# EasyEDA Pro project ProProject_stepper_music_2024-12-04.epro

# Schematic Schematic1
Create Date: 2024-01-15; Page Name: P1; Project Name: stepper_music; Schematic Name: Schematic1; Update Date: 2024-01-16; Company: 嘉立创EDA; Page Size: A4; Version: V1.0
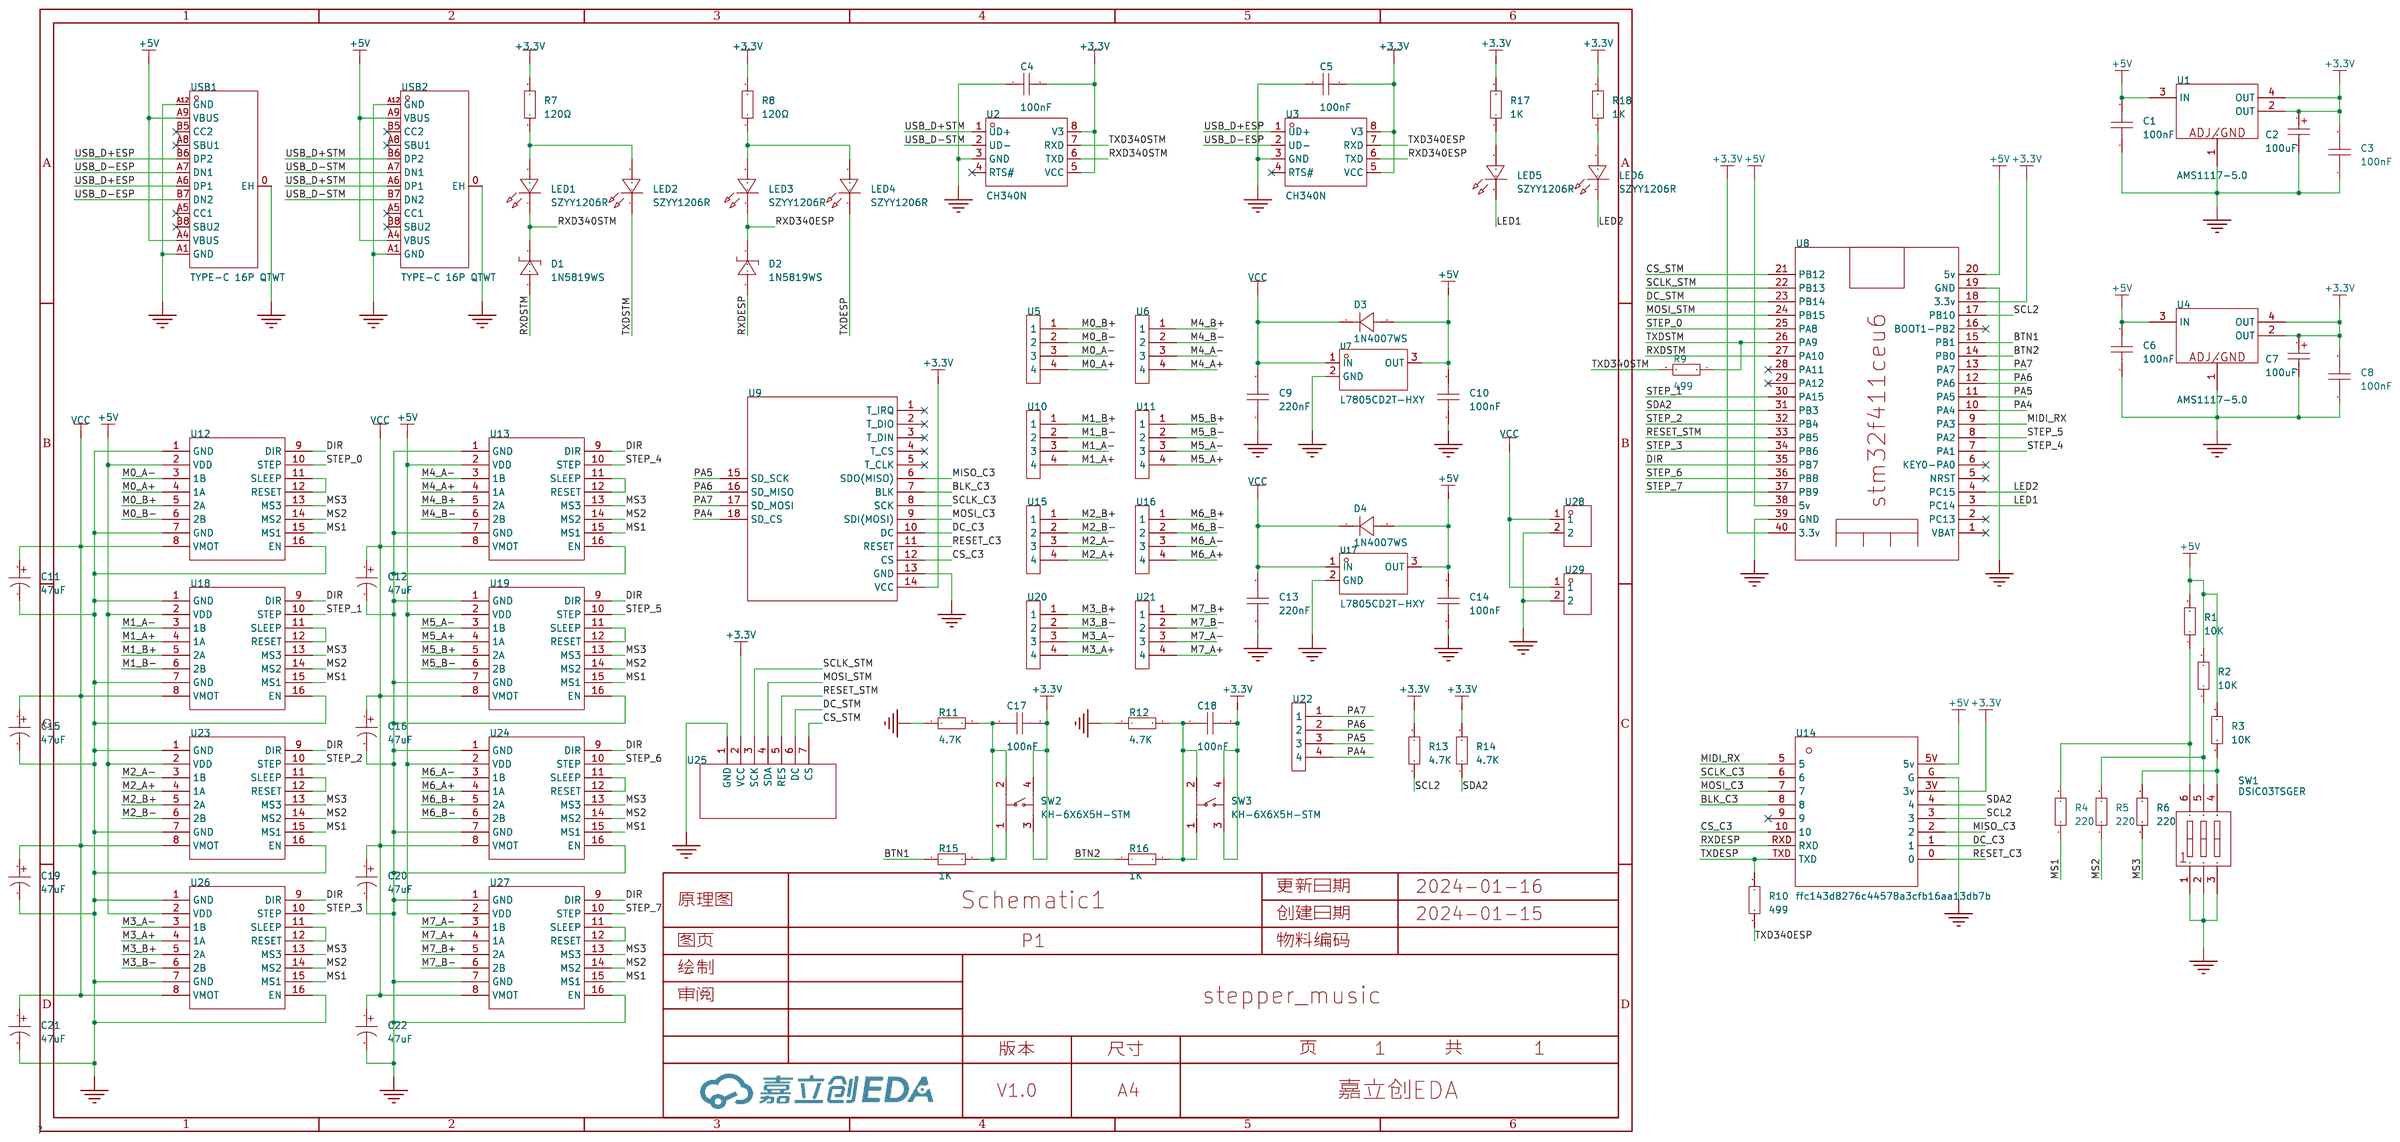
[diagram p0: schematic sheet]

## Parts
C1  100nF  [C1206_]
C2  100uF  [CASE-D_7343]
C3  100nF  [C1206_]
C4  100nF  [C1206_]
C5  100nF  [C1206_]
C6  100nF  [C1206_]
C7  100uF  [CASE-D_7343]
C8  100nF  [C1206_]
C9  220nF  [C1206_]
C10  100nF  [C1206_]
C11  47uF  [CAP-TH_BD6.3-P2.50-D1.0-FD]
C12  47uF  [CAP-TH_BD6.3-P2.50-D1.0-FD]
C13  220nF  [C1206_]
C14  100nF  [C1206_]
C15  47uF  [CAP-TH_BD6.3-P2.50-D1.0-FD]
C16  47uF  [CAP-TH_BD6.3-P2.50-D1.0-FD]
C17  100nF  [C1206_]
C18  100nF  [C1206_]
C19  47uF  [CAP-TH_BD6.3-P2.50-D1.0-FD]
C20  47uF  [CAP-TH_BD6.3-P2.50-D1.0-FD]
C21  47uF  [CAP-TH_BD6.3-P2.50-D1.0-FD]
C22  47uF  [CAP-TH_BD6.3-P2.50-D1.0-FD]
D1  1N5819WS  [SOD-323_L1.8-W1.3-LS2.5-RD]
D2  1N5819WS  [SOD-323_L1.8-W1.3-LS2.5-RD]
D3  1N4007WS  [SOD-323_L1.6-W1.3-LS2.7-RD]
D4  1N4007WS  [SOD-323_L1.6-W1.3-LS2.7-RD]
LED1  SZYY1206R  [LED1206-RD-R_RED]
LED2  SZYY1206R  [LED1206-RD-R_RED]
LED3  SZYY1206R  [LED1206-RD-R_RED]
LED4  SZYY1206R  [LED1206-RD-R_RED]
LED5  SZYY1206R  [LED1206-RD-R_RED]
LED6  SZYY1206R  [LED1206-RD-R_RED]
R1  10K  [R1206-1]
R2  10K  [R1206-1]
R3  10K  [R1206-1]
R4  220  [R1206-1]
R5  220  [R1206-1]
R6  220  [R1206-1]
R7  120Ω  [R1206-1]
R8  120Ω  [R1206-1]
R9  499  [R1206-1]
R10  499  [R1206-1]
R11  4.7K  [R1206-1]
R12  4.7K  [R1206-1]
R13  4.7K  [R1206-1]
R14  4.7K  [R1206-1]
R15  1K  [R1206-1]
R16  1K  [R1206-1]
R17  1K  [R1206-1]
R18  1K  [R1206-1]
SW1  DSIC03TSGER  [SW-SMD_3P-L7.6-W6.0-P2.54-LS9.3-BL]
SW2  KH-6X6X5H-STM  [SW-SMD_4P-L6.0-W6.0-P4.50-LS9.0-2]
SW3  KH-6X6X5H-STM  [SW-SMD_4P-L6.0-W6.0-P4.50-LS9.0-2]
U1  AMS1117-5.0  [SOT-223-3_L6.4-W3.5-P2.30-LS7.0-BR]
U2  CH340N  [SOP-8_L4.9-W3.9-P1.27-LS6.0-BL]
U3  CH340N  [SOP-8_L4.9-W3.9-P1.27-LS6.0-BL]
U4  AMS1117-5.0  [SOT-223-3_L6.4-W3.5-P2.30-LS7.0-BR]
U5  -  [2.54 - 4P]
U6  -  [2.54 - 4P]
U7  L7805CD2T-HXY  [TO-263-2_L10.2-W8.5-P2.54-LS15.2-TL]
U8  -  [stm32f411ceu6]
U9  -  [2.8inch TFT LCD]
U10  -  [2.54 - 4P]
U11  -  [2.54 - 4P]
U12  -  [a4988 module]
U13  -  [a4988 module]
U14  ffc143d8276c44578a3cfb16aa13db7b  [esp32c3-mini]
U15  -  [2.54 - 4P]
U16  -  [2.54 - 4P]
U17  L7805CD2T-HXY  [TO-263-2_L10.2-W8.5-P2.54-LS15.2-TL]
U18  -  [a4988 module]
U19  -  [a4988 module]
U20  -  [2.54 - 4P]
U21  -  [2.54 - 4P]
U22  -  [2.54 - 4P]
U23  -  [a4988 module]
U24  -  [a4988 module]
U25  -  [1.3inch OLED module]
U26  -  [a4988 module]
U27  -  [a4988 module]
U28  ={Manufacturer Part} /  [CONN-TH_2P-P5.00_L7.6-W10.0]
U29  ={Manufacturer Part} /  [CONN-TH_2P-P5.00_L7.6-W10.0]
USB1  TYPE-C 16P QTWT  [USB-TYPE-C-SMD_TYPE-C-16P-QTWT]
USB2  TYPE-C 16P QTWT  [USB-TYPE-C-SMD_TYPE-C-16P-QTWT]

## Library data of the parts
C1 C3 C6 C8-C10 C13 C14 C17 C18 = CAP_0603: Supplier Footprint: 0603
C2 C7 = TAJD337K010RNJ: 容值:330uF;精度:±10%;额定电压:10V;等效串联电阻:900mΩ@100kHz;工作温度:-55℃~+125℃;; LCSC Part Name: 330uF ±10% 10V; Supplier Part: C7226; Manufacturer: Kyocera AVX; JLCPCB Part Class: 扩展库; Datasheet: https://atta.szlcsc.com/upload/public/pdf/source/20160107/1457707749490.pdf; Supplier: LCSC; Tolerance: ±10%; Rated Voltage: 10V; Equivalent Series Resistance(ESR): 900mΩ@100kHz; Operating Temperature: -55℃~+125℃
C4 C5 = CL05B104KO5NNNC: 容值:100nF;精度:±10%;额定电压:16V;材质(温度系数):X7R;; LCSC Part Name: 100nF ±10% 16V; Supplier Part: C1525; Manufacturer: SAMSUNG(三星); Supplier Footprint: 0402; JLCPCB Part Class: Basic Part; Datasheet: https://atta.szlcsc.com/upload/public/pdf/source/20160103/1457707674891.pdf; Supplier: LCSC; Tolerance: ±10%; Voltage Rated: 16V; Temperature Coefficient: X7R
C11 C12 C15 C16 C19-C22 = KM476M050E11RR0VH2FP0: 容值:47uF;精度:±20%;额定电压:50V;; LCSC Part Name: 47uF ±20% 50V; Supplier Part: C45101; Manufacturer: CX(承兴); Supplier Footprint: 插件,D6.3xL11mm; JLCPCB Part Class: 扩展库; Datasheet: https://atta.szlcsc.com/upload/public/pdf/source/20230413/4F329AA96A66424FD3FF29340EA7427F.pdf; Supplier: LCSC; Tolerance: ±20%; Rated Voltage: 50V; Lead Spacing: 2.5mm; φD: 6.3mm; L: 11mm; Lifetime @ Temp: 1000hrs@105℃
D1 D2 = 1N5819WS_C191023: 直流反向耐压(Vr):40V;平均整流电流(Io):1A;正向压降(Vf):600mV@1A;; LCSC Part Name: 40V 1A 600mV@1A; Supplier Part: C191023; Manufacturer: Hottech(合科泰); Supplier Footprint: SOD-323; JLCPCB Part Class: Basic Part; Datasheet: https://atta.szlcsc.com/upload/public/pdf/source/20220428/3CB86FD8D28D653594B4E35F9D5AEFD9.pdf; Supplier: LCSC; Reverse Voltage (Vr): 40V; Average Rectified Current (Io): 1A; Forward Voltage (Vf@If): 600mV@1A
D3 D4 = 1N4007WS_C2687395: 二极管配置:-;正向压降(Vf):1V@50mA;直流反向耐压(Vr):300V;平均整流电流(Io):300mA;; LCSC Part Name: 电压:300V 电流:300mA; Supplier Part: C2687395; Manufacturer: JSMSEMI(杰盛微); Supplier Footprint: SOD-323; JLCPCB Part Class: 扩展库; Datasheet: https://atta.szlcsc.com/upload/public/pdf/source/20220125/703811846266D8EFA59826CD7BEA3161.pdf; Supplier: LCSC; Forward Voltage (Vf@If): 1V@50mA; Reverse Voltage (Vr): 300V; Average Rectified Current (Io): 300mA; Reverse Leakage Current: 1uA@75V
LED1-LED6 = SZYY1206R: 发光颜色:红灯;二极管配置:-;主波长:615nm~630nm;色温:-;功率:40mW;安装方式:-;; LCSC Part Name: 红灯; Supplier Part: C434438; Manufacturer: yongyu(永裕光电); Supplier Footprint: 1206; JLCPCB Part Class: Extended Part; Datasheet: https://atta.szlcsc.com/upload/public/pdf/source/20200628/C434438_2D67D2A0D30E1ECD9789F51185A39ACF.pdf; Supplier: LCSC; Emitted Color: 红灯; Lens Color: 无色透明; Dominant Wavelength: 615nm~630nm; Peak Wavelength: 645nm; Forward Current: 20mA; Power Dissipation: 40mW; Viewing Angle: 120°; Operating Temperature: -40℃~+85℃
R1-R6 R9-R18 = Res_0603: Supplier Footprint: 0603
R7 R8 = 0603WAF1200T5E: 电阻类型:厚膜电阻;阻值:120Ω;精度:±1%;功率:100mW;; LCSC Part Name: 120Ω ±1% 100mW; Supplier Part: C22787; Manufacturer: UNI-ROYAL(厚声); Supplier Footprint: 0603; JLCPCB Part Class: Basic Part; Datasheet: https://atta.szlcsc.com/upload/public/pdf/source/20200306/C422600_1E6D84923E4A46A82E41ADD87F860B5C.pdf; Supplier: LCSC; Type: 厚膜电阻; Tolerance: ±1%; Power(Watts): 100mW; Temperature Coefficient: ±100ppm/℃; Overload Voltage (Max): 75V; Operating Temperature Range: -55℃~+155℃
SW1 = DSIC03TSGER: 电路结构:单刀单掷;开关位数:3位;额定电流:25mA;额定电压:24V;使用寿命:3千次;颜色:黑色;; LCSC Part Name: 3位 2.54mm脚距 低手柄 拨码开关; Supplier Part: C5123695; Manufacturer: 康深; Supplier Footprint: SMD-6P,6x7.6mm; JLCPCB Part Class: Extended Part; Datasheet: https://atta.szlcsc.com/upload/public/pdf/source/20220802/2B0B0211448CD9140CAD8FC2231D587F.pdf; Supplier: LCSC; Circuit: 单刀单掷; Number of Positions: 3位; Lead Pitch: 2.54mm; Current Rating: 25mA; Voltage Rating: 24V; Operating Temperature: -30℃~+85℃; Operating Life: 3千次; Color: 黑色
SW2 SW3 = KH-6X6X5H-STM: 电路结构:单刀单掷;带支架:否;触点电流:50mA;额定电压(DC):12V;安装方式:立贴;机械寿命:8万次;; LCSC Part Name: 6*6*5mm 立贴 轻触开关; Supplier Part: C2837531; Manufacturer: kinghelm(金航标); Supplier Footprint: SMD; JLCPCB Part Class: Extended Part; Datasheet: https://atta.szlcsc.com/upload/public/pdf/source/20210608/C2837531_45E87AB996CE723B09405FF2EA209C4C.pdf; Supplier: LCSC; Circuit: 单刀单掷; Actuator Style: 圆形按钮; Switch Length: 6mm; Switch Width: 6mm; Switch Height: 5mm; Strike Gundam: 否; Contact Current: 50mA; Voltage Rating (DC): 12V; Mounting Style: 立贴; Actuator/Cap Color: 黑色; Pin Style: 鸥翼型; Mechanical Life: 8万次
U1 U4 = AMS1117-5.0_C2992571: Supplier Part: C2992571; Manufacturer: 国芯佳品; Supplier Footprint: SOT-223-3; JLCPCB Part Class: Extended Part; Datasheet: https://atta.szlcsc.com/upload/public/pdf/source/20220729/0D21C21EC310E4778671BF6BAE438640.pdf; Supplier: LCSC
U2 U3 = CH340N: LCSC Part Name: USB转串口芯片 CH340; Supplier Part: C2977777; Manufacturer: WCH(南京沁恒); Supplier Footprint: SOP-8; JLCPCB Part Class: Extended Part; Datasheet: https://atta.szlcsc.com/upload/public/pdf/source/20220223/82A45E4FF89B3EDCAD50B354450A7EF4.pdf; Supplier: LCSC
U5 U6 U10 U11 U15 U16 U20-U22 = 2.54 - 4P: 间距2.54排针 4P
U7 U17 = L7805CD2T-HXY: 输出类型:固定;最大输入电压:35V;输出电压:5V;输出电流:1A;输出极性:正;; LCSC Part Name: L7805CD2T 输入35V 输出5V 1A L7805C2T; Supplier Part: C7469133; Manufacturer: HXY MOSFET(华轩阳电子); Supplier Footprint: TO-263; JLCPCB Part Class: 扩展库; Datasheet: https://atta.szlcsc.com/upload/public/pdf/source/20230804/7B1B56C03EC7F4A7A79582162CF47805.pdf; Supplier: LCSC; Output Type: 固定; Maximum Input Voltage: 35V; Output Voltage: 5V; Output Current: 1A; Output Polarity: 正; Number of Outputs: 1
U8 = stm3f411ceu6: stm32f411ceu6 https://www.taobao.com/list/item/594670660262.htm
U9 = 2.8inch TFT LCD: Driver: ILI9341
U12 U13 U18 U19 U23 U24 U26 U27 = a4988: a4988 stepper motor driver module
U14 = esp32c3_super_mini: esp32c3-mini No-logo
U25 = 1.3 inch OLED: SH1106 Driver 128*64
U28 U29 = DB301V-5.0-2P-BU-S: 间距:5mm;结构:1x2P;排数:1;每排PIN数:2;安装方式:直插;额定电流:17.5A;额定电压:250V;线规 - AWG:14~22;线规 - mm2:1.5;工作温度范围:-40℃~+120℃;颜色:蓝色;; LCSC Part Name: 5mm 1x2P 排数:1 每排P数:2 直插; Supplier Part: C395882; Manufacturer: DIBO(地博电气); Supplier Footprint: 插件,P=5mm; JLCPCB Part Class: Extended Part; Datasheet: https://atta.szlcsc.com/upload/public/pdf/source/20230321/D511151DA9A574FE7610C3CBEF6C1AC3.pdf; Supplier: LCSC; Pitch: 5mm; Structure: 1x2P; Number of Rows: 1; Number of PINs Per Row: 2; Mounting Style: 直插; Current Rating (Max): 17.5A; Voltage Rating (Max): 250V; Wire Gauge - AWG: 14~22; Wire Gauge - mm2: 1.5; Operating Temperature Range: -40℃~+120℃; Color: 蓝色; Number of Pins: 2P
USB1 USB2 = TYPE-C 16P QTWT: 连接器类型:Type-C;标准:-;公母:母;端口数量:1;触点数量:16P;安装方式:卧贴;额定电流 - 电源:3A;触头材质:-;触头镀层:-;工作温度范围:-25℃~+85℃;焊接温度(最大值):-;; LCSC Part Name: Type-C 母 卧贴; Supplier Part: C5187472; Manufacturer: SHOU HAN(首韩); Supplier Footprint: SMD; JLCPCB Part Class: 扩展库; Datasheet: https://atta.szlcsc.com/upload/public/pdf/source/20220929/9CA39B32C19F2C1116A695DA9353B6B2.pdf; Supplier: LCSC; Connector Type: Type-C; Gender: 母; Number of Ports: 1; Number of Contacts: 16P; Mounting Style: 卧贴; Current Rating - Power (Max): 3A; Operating Temperature Range: -25℃~+85℃

## Nets
+3.3V: C2.1 C3.2 C4.2 C5.2 C7.1 C8.2 C17.2 C18.2 R7.2 R8.2 R13.2 R14.2 R17.2 R18.2 SW2.3 SW2.4 SW3.3 SW3.4 U1.2(OUT) U1.4(OUT) U2.5(VCC) U2.8(V3) U3.5(VCC) U3.8(V3) U4.2(OUT) U4.4(OUT) U8.18(3.3v) U8.40(3.3v) U9.14(VCC) U14.3V(3v) U25.2(VCC)
+5V: C1.2 C6.2 C10.2 C14.2 D3.2(A) D4.2(A) R1.2 R2.2 R3.2 U1.3(IN) U4.3(IN) U7.3(OUT) U8.20(5v) U8.38(5v) U12.2(VDD) U13.2(VDD) U14.5V(5v) U17.3(OUT) U18.2(VDD) U19.2(VDD) U23.2(VDD) U24.2(VDD) U26.2(VDD) U27.2(VDD) USB1.A4(VBUS) USB1.A9(VBUS) USB2.A4(VBUS) USB2.A9(VBUS)
GND: C1.1 C2.2 C3.1 C4.1 C5.1 C6.1 C7.2 C8.1 C9.1 C10.1 C11.2 C12.2 C13.1 C14.1 C15.2 C16.2 C19.2 C20.2 C21.2 C22.2 R11.1 R12.1 SW1.1(A1) SW1.2(A2) SW1.3(A3) U1.1(ADJ/GND) U2.3(GND) U3.3(GND) U4.1(ADJ/GND) U7.2(GND) U8.19(GND) U8.39(GND) U9.13(GND) U12.1(GND) U12.7(GND) U12.16(EN) U13.1(GND) U13.7(GND) U13.16(EN) U14.G U17.2(GND) U18.1(GND) U18.7(GND) U18.16(EN) U19.1(GND) U19.7(GND) U19.16(EN) U23.1(GND) U23.7(GND) U23.16(EN) U24.1(GND) U24.7(GND) U24.16(EN) U25.1(GND) U26.1(GND) U26.7(GND) U26.16(EN) U27.1(GND) U27.7(GND) U27.16(EN) U28.2 U29.2 USB1.0(EH) USB1.A1(GND) USB1.A12(GND) USB2.0(EH) USB2.A1(GND) USB2.A12(GND)
VCC: C9.2 C11.1 C12.1 C13.2 C15.1 C16.1 C19.1 C20.1 C21.1 C22.1 D3.1(K) D4.1(K) U7.1(IN) U12.8(VMOT) U13.8(VMOT) U17.1(IN) U18.8(VMOT) U19.8(VMOT) U23.8(VMOT) U24.8(VMOT) U26.8(VMOT) U27.8(VMOT) U28.1 U29.1
BLK_C3: U9.7(BLK) U14.8
BTN1: R15.1 U8.15(PB1)
BTN2: R16.1 U8.14(PB0)
CS_C3: U9.12(CS) U14.10
CS_STM: U8.21(PB12) U25.7(CS)
DC_C3: U9.10(DC) U14.1
DC_STM: U8.23(PB14) U25.6(DC)
DIR: U8.35(PB7) U12.9(DIR) U13.9(DIR) U18.9(DIR) U19.9(DIR) U23.9(DIR) U24.9(DIR) U26.9(DIR) U27.9(DIR)
LED1: LED5.1 U8.3(PC14)
LED2: LED6.1 U8.4(PC15)
M0_A+: U5.4 U12.4(1A)
M0_A-: U5.3 U12.3(1B)
M0_B+: U5.1 U12.5(2A)
M0_B-: U5.2 U12.6(2B)
M1_A+: U10.4 U18.4(1A)
M1_A-: U10.3 U18.3(1B)
M1_B+: U10.1 U18.5(2A)
M1_B-: U10.2 U18.6(2B)
M2_A+: U15.4 U23.4(1A)
M2_A-: U15.3 U23.3(1B)
M2_B+: U15.1 U23.5(2A)
M2_B-: U15.2 U23.6(2B)
M3_A+: U20.4 U26.4(1A)
M3_A-: U20.3 U26.3(1B)
M3_B+: U20.1 U26.5(2A)
M3_B-: U20.2 U26.6(2B)
M4_A+: U6.4 U13.4(1A)
M4_A-: U6.3 U13.3(1B)
M4_B+: U6.1 U13.5(2A)
M4_B-: U6.2 U13.6(2B)
M5_A+: U11.4 U19.4(1A)
M5_A-: U11.3 U19.3(1B)
M5_B+: U11.1 U19.5(2A)
M5_B-: U11.2 U19.6(2B)
M6_A+: U16.4 U24.4(1A)
M6_A-: U16.3 U24.3(1B)
M6_B+: U16.1 U24.5(2A)
M6_B-: U16.2 U24.6(2B)
M7_A+: U21.4 U27.4(1A)
M7_A-: U21.3 U27.3(1B)
M7_B+: U21.1 U27.5(2A)
M7_B-: U21.2 U27.6(2B)
MIDI_RX: U8.9(PA3) U14.5
MISO_C3: U9.6(SDO(MISO)) U14.2
MOSI_C3: U9.9(SDI(MOSI)) U14.7
MOSI_STM: U8.24(PB15) U25.4(SDA)
MS1: R4.1 U12.15(MS1) U13.15(MS1) U18.15(MS1) U19.15(MS1) U23.15(MS1) U24.15(MS1) U26.15(MS1) U27.15(MS1)
MS2: R5.1 U12.14(MS2) U13.14(MS2) U18.14(MS2) U19.14(MS2) U23.14(MS2) U24.14(MS2) U26.14(MS2) U27.14(MS2)
MS3: R6.1 U12.13(MS3) U13.13(MS3) U18.13(MS3) U19.13(MS3) U23.13(MS3) U24.13(MS3) U26.13(MS3) U27.13(MS3)
PA4: U8.10(PA4) U9.18(SD_CS) U22.4
PA5: U8.11(PA5) U9.15(SD_SCK) U22.3
PA6: U8.12(PA6) U9.16(SD_MISO) U22.2
PA7: U8.13(PA7) U9.17(SD_MOSI) U22.1
RESET_C3: U9.11(RESET) U14.0
RESET_STM: U8.33(PB5) U25.5(RES)
RXD340ESP: D2.1(C) LED3.1 U3.6(TXD)
RXD340STM: D1.1(C) LED1.1 U2.6(TXD)
RXDESP: D2.2(A) U14.RXD
RXDSTM: D1.2(A) U8.27(PA10)
SCL2: R13.1 U8.17(PB10) U14.3
SCLK_C3: U9.8(SCK) U14.6
SCLK_STM: U8.22(PB13) U25.3(SCK)
SDA2: R14.1 U8.31(PB3) U14.4
STEP_0: U8.25(PA8) U12.10(STEP)
STEP_1: U8.30(PA15) U18.10(STEP)
STEP_2: U8.32(PB4) U23.10(STEP)
STEP_3: U8.34(PB6) U26.10(STEP)
STEP_4: U8.7(PA1) U13.10(STEP)
STEP_5: U8.8(PA2) U19.10(STEP)
STEP_6: U8.36(PB8) U24.10(STEP)
STEP_7: U8.37(PB9) U27.10(STEP)
TXD340ESP: R10.1 U3.7(RXD)
TXD340STM: R9.2 U2.7(RXD)
TXDESP: LED4.1 R10.2 U14.TXD
TXDSTM: LED2.1 R9.1 U8.26(PA9)
USB_D+ESP: U3.1(UD+) USB1.A6(DP1) USB1.B6(DP2)
USB_D+STM: U2.1(UD+) USB2.A6(DP1) USB2.B6(DP2)
USB_D-ESP: U3.2(UD-) USB1.A7(DN1) USB1.B7(DN2)
USB_D-STM: U2.2(UD-) USB2.A7(DN1) USB2.B7(DN2)
$1N1936: LED3.2 LED4.2 R8.1
$1N2808: LED1.2 LED2.2 R7.1
$1N4483: U26.11(SLEEP) U26.12(RESET)
$1N4488: U27.11(SLEEP) U27.12(RESET)
$1N4493: U23.11(SLEEP) U23.12(RESET)
$1N4498: U24.11(SLEEP) U24.12(RESET)
$1N4503: U19.11(SLEEP) U19.12(RESET)
$1N4508: U13.11(SLEEP) U13.12(RESET)
$1N4513: U12.11(SLEEP) U12.12(RESET)
$1N4518: U18.11(SLEEP) U18.12(RESET)
$1N11425: LED5.2 R17.1
$1N11428: LED6.2 R18.1
$1N16587: C17.1 R11.2 R15.2 SW2.1 SW2.2
$1N16647: C18.1 R12.2 R16.2 SW3.1 SW3.2
$1N18562: R3.1 R6.2 SW1.4(B3)
$1N18573: R2.1 R5.2 SW1.5(B2)
$1N18582: R1.1 R4.2 SW1.6(B1)

Not connected (* = marked no-connect by the designer): U2 4(RTS#)*; U3 4(RTS#)*; U8 1(VBAT)* 2(PC13)* 5(NRST)* 6(KEY0-PA0)* 16(BOOT1-PB2)* 28(PA11)* 29(PA12)*; U9 1(T_IRQ)* 2(T_DIO)* 3(T_DIN)* 4(T_CS)* 5(T_CLK)*; U14 9*; USB1 A5(CC1)* A8(SBU1)* B5(CC2)* B8(SBU2)*; USB2 A5(CC1)* A8(SBU1)* B5(CC2)* B8(SBU2)*

# Board PCB1
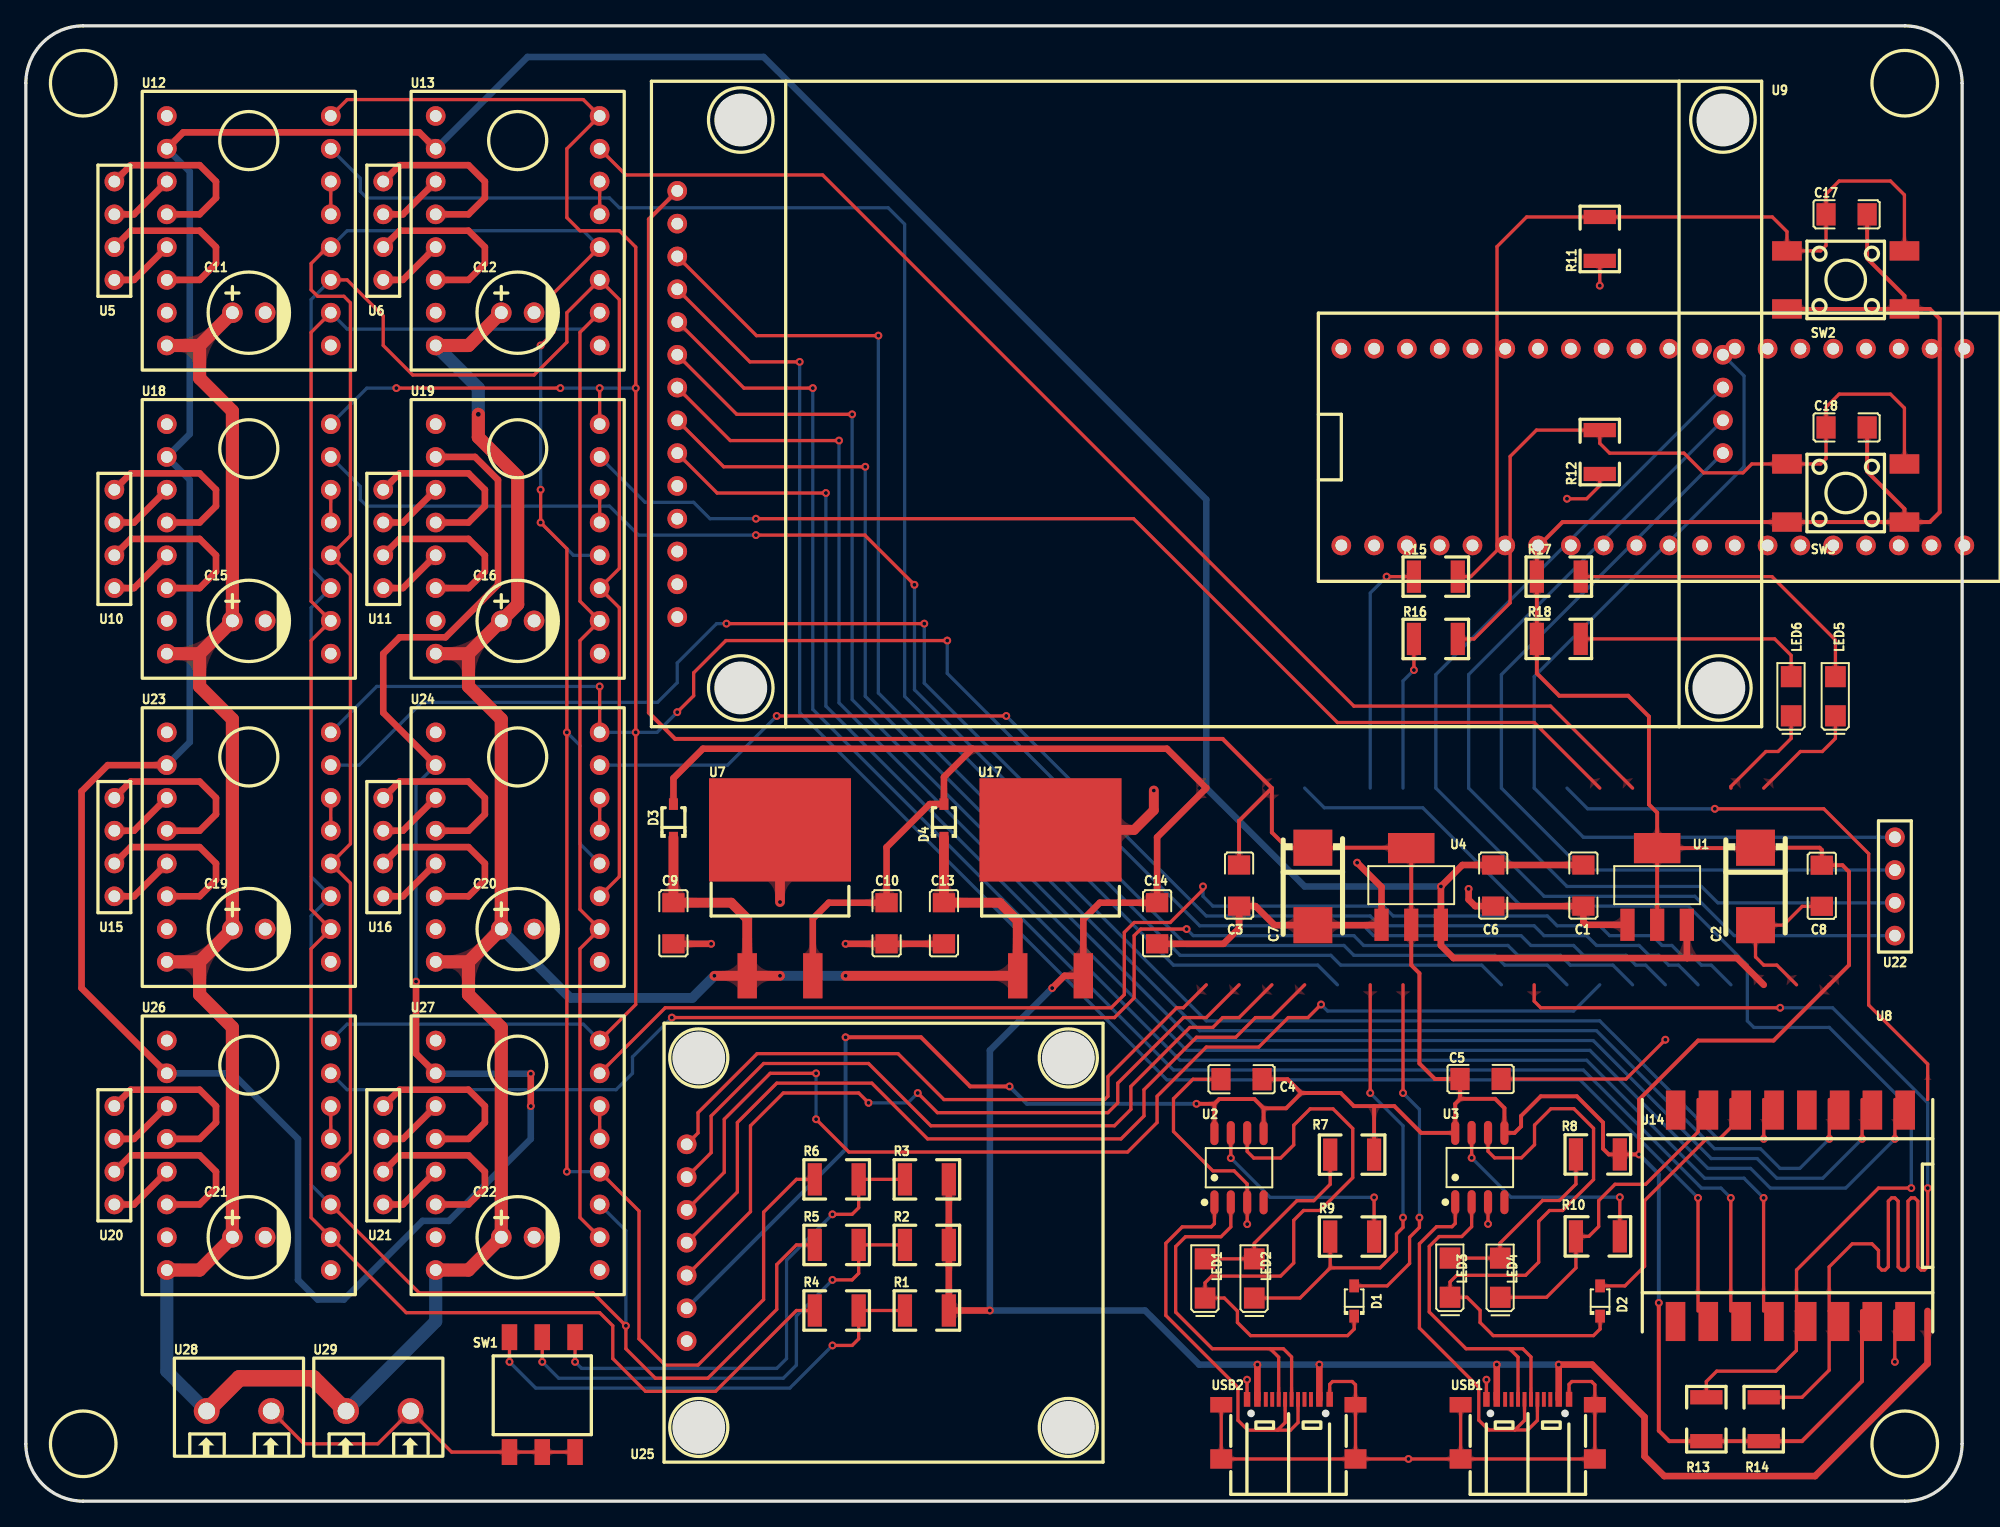
[diagram p1: board, top side]
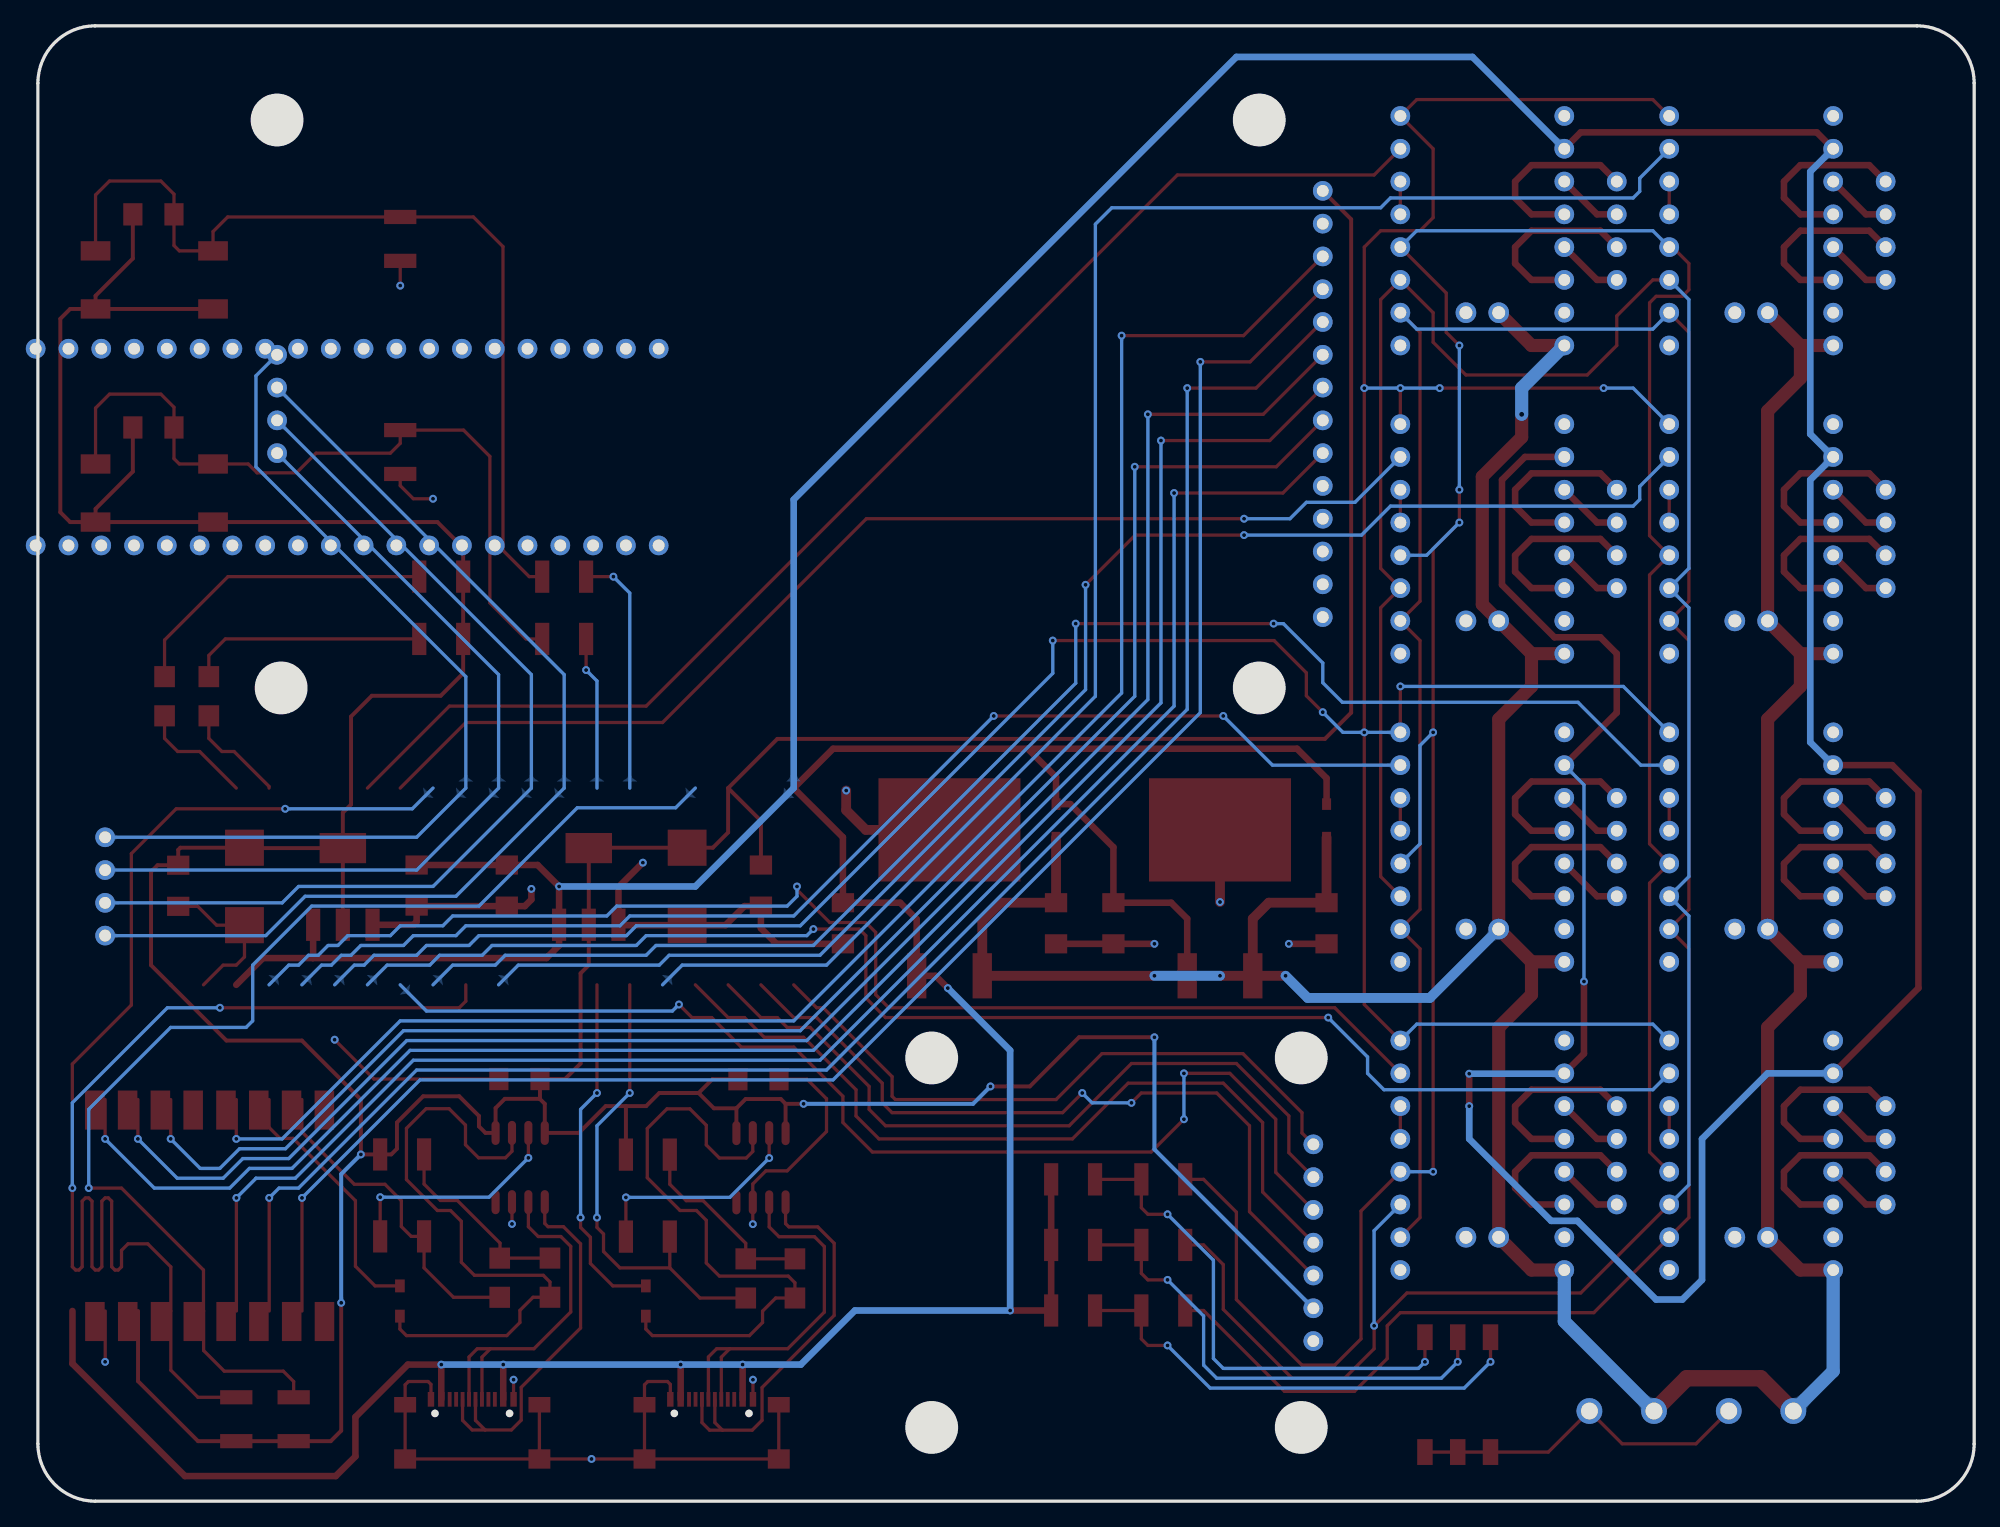
[diagram p2: board, bottom side, seen from below]

Outline 149.99 x 114.3 mm; copper layers: Top Layer, Bottom Layer. Coordinates in mm from the lower left corner of the outline.
Outline path: 0,109.85 0,4.44 arc(1.3,1.3) 4.44,0 145.54,0 arc(148.69,1.3) 149.99,4.44 149.99,109.85 arc(148.69,113) 145.54,114.3 4.44,114.3 arc(1.3,113) 0,109.85
Stack: Top Layer 0.035mm / Dielectric1 1.51mm FR4 er 4.5 / Bottom Layer 0.035mm

## Design rules (mm)
template: JLCPCB Capability(Two Layers Board)
spacing copperThickness1oz (default): track to track 0.102, other pairs 0.152 to 0.3
spacing copperThickness2oz: track to track 0.203, other pairs 0.152 to 0.3
track width copperThickness1oz (default): min 0.127, default 0.254, max 2.54
track width copperThickness2oz: min 0.203, default 0.254, max 2.54
differential pair differentialPair (default): width min 0.127, default 0.254, max 2.54; gap min 0.152, default 0.152
via viaSize (default): diameter min 0.5, default 0.61, max 10; hole min 0.3, default 0.305, max 6.3

## Placement (name value [footprint] x y rotation side)
C1  100nF  [C1206_]  120.65 47.62 90 top
C2  100uF  [CASE-D_7343]  133.99 47.62 90 top
C3  100nF  [C1206_]  93.98 47.62 90 top
C4  100nF  [C1206_]  94.1 32.69 0 top
C5  100nF  [C1206_]  112.76 32.71 180 top
C6  100nF  [C1206_]  113.66 47.62 90 top
C7  100uF  [CASE-D_7343]  99.69 47.62 90 top
C8  100nF  [C1206_]  139.12 47.61 90 top
C9  220nF  [C1206_]  50.17 44.7 90 top
C10  100nF  [C1206_]  66.68 44.7 90 top
C11  47uF  [CAP-TH_BD6.3-P2.50-D1.0-FD]  17.27 92.07 0 top
C12  47uF  [CAP-TH_BD6.3-P2.50-D1.0-FD]  38.1 92.07 0 top
C13  220nF  [C1206_]  71.12 44.7 90 top
C14  100nF  [C1206_]  87.63 44.7 90 top
C15  47uF  [CAP-TH_BD6.3-P2.50-D1.0-FD]  17.27 68.2 0 top
C16  47uF  [CAP-TH_BD6.3-P2.50-D1.0-FD]  38.1 68.2 0 top
C17  100nF  [C1206_]  140.97 99.69 0 top
C18  100nF  [C1206_]  140.97 83.18 0 top
C19  47uF  [CAP-TH_BD6.3-P2.50-D1.0-FD]  17.27 44.32 0 top
C20  47uF  [CAP-TH_BD6.3-P2.50-D1.0-FD]  38.1 44.32 0 top
C21  47uF  [CAP-TH_BD6.3-P2.50-D1.0-FD]  17.27 20.45 0 top
C22  47uF  [CAP-TH_BD6.3-P2.50-D1.0-FD]  38.1 20.45 0 top
D1  1N5819WS  [SOD-323_L1.8-W1.3-LS2.5-RD]  102.9 15.51 90 top
D2  1N5819WS  [SOD-323_L1.8-W1.3-LS2.5-RD]  121.94 15.51 90 top
D3  1N4007WS  [SOD-323_L1.6-W1.3-LS2.7-RD]  50.17 52.7 90 top
D4  1N4007WS  [SOD-323_L1.6-W1.3-LS2.7-RD]  71.12 52.7 90 top
LED1  SZYY1206R  [LED1206-RD-R_RED]  91.35 17.26 90 top
LED2  SZYY1206R  [LED1206-RD-R_RED]  95.16 17.26 90 top
LED3  SZYY1206R  [LED1206-RD-R_RED]  110.32 17.32 90 top
LED4  SZYY1206R  [LED1206-RD-R_RED]  114.21 17.31 90 top
LED5  SZYY1206R  [LED1206-RD-R_RED]  140.17 62.36 90 top
LED6  SZYY1206R  [LED1206-RD-R_RED]  136.75 62.36 90 top
R1  10K  [R1206-1]  69.8 14.77 0 top
R2  10K  [R1206-1]  69.8 19.85 0 top
R3  10K  [R1206-1]  69.8 24.93 0 top
R4  220  [R1206-1]  62.81 14.77 0 top
R5  220  [R1206-1]  62.81 19.85 0 top
R6  220  [R1206-1]  62.81 24.93 0 top
R7  120Ω  [R1206-1]  102.74 26.85 0 top
R8  120Ω  [R1206-1]  121.77 26.86 0 top
R9  499  [R1206-1]  102.74 20.5 0 top
R10  499  [R1206-1]  121.77 20.51 180 top
R11  4.7K  [R1206-1]  121.92 97.79 90 top
R12  4.7K  [R1206-1]  121.92 81.28 90 top
R13  4.7K  [R1206-1]  130.18 6.35 270 top
R14  4.7K  [R1206-1]  134.62 6.35 270 top
R15  1K  [R1206-1]  109.22 71.63 0 top
R16  1K  [R1206-1]  109.22 66.8 0 top
R17  1K  [R1206-1]  118.75 71.63 180 top
R18  1K  [R1206-1]  118.75 66.8 180 top
SW1  DSIC03TSGER  [SW-SMD_3P-L7.6-W6.0-P2.54-LS9.3-BL]  40 8.25 0 top
SW2  KH-6X6X5H-STM  [SW-SMD_4P-L6.0-W6.0-P4.50-LS9.0-2]  140.97 94.61 0 top
SW3  KH-6X6X5H-STM  [SW-SMD_4P-L6.0-W6.0-P4.50-LS9.0-2]  140.97 78.1 0 top
U1  AMS1117-5.0  [SOT-223-3_L6.4-W3.5-P2.30-LS7.0-BR]  126.37 47.62 270 top
U2  CH340N  [SOP-8_L4.9-W3.9-P1.27-LS6.0-BL]  93.97 25.83 0 top
U3  CH340N  [SOP-8_L4.9-W3.9-P1.27-LS6.0-BL]  112.63 25.85 0 top
U4  AMS1117-5.0  [SOT-223-3_L6.4-W3.5-P2.30-LS7.0-BR]  107.31 47.62 270 top
U5  -  [2.54 - 4P]  6.86 94.61 90 top
U6  -  [2.54 - 4P]  27.69 94.61 90 top
U7  L7805CD2T-HXY  [TO-263-2_L10.2-W8.5-P2.54-LS15.2-TL]  58.42 46.35 90 top
U8  -  [stm32f411ceu6]  139.7 55.24 90 top
U9  -  [2.8inch TFT LCD]  50.46 68.49 270 top
U10  -  [2.54 - 4P]  6.86 70.74 90 top
U11  -  [2.54 - 4P]  27.69 70.74 90 top
U12  -  [a4988 module]  10.92 107.31 0 top
U13  -  [a4988 module]  31.75 107.31 0 top
U14  ffc143d8276c44578a3cfb16aa13db7b  [esp32c3-mini]  147.32 31.11 270 top
U15  -  [2.54 - 4P]  6.86 46.86 90 top
U16  -  [2.54 - 4P]  27.69 46.86 90 top
U17  L7805CD2T-HXY  [TO-263-2_L10.2-W8.5-P2.54-LS15.2-TL]  79.38 46.35 90 top
U18  -  [a4988 module]  10.92 83.44 0 top
U19  -  [a4988 module]  31.75 83.44 0 top
U20  -  [2.54 - 4P]  6.86 22.99 90 top
U21  -  [2.54 - 4P]  27.69 22.99 90 top
U22  -  [2.54 - 4P]  144.78 43.81 90 top
U23  -  [a4988 module]  10.92 59.56 0 top
U24  -  [a4988 module]  31.75 59.56 0 top
U25  -  [1.3inch OLED module]  83.44 3.03 90 top
U26  -  [a4988 module]  10.92 35.69 0 top
U27  -  [a4988 module]  31.75 35.69 0 top
U28  ={Manufacturer Part} /  [CONN-TH_2P-P5.00_L7.6-W10.0]  16.51 6.98 0 top
U29  ={Manufacturer Part} /  [CONN-TH_2P-P5.00_L7.6-W10.0]  27.31 6.98 0 top
USB1  TYPE-C 16P QTWT  [USB-TYPE-C-SMD_TYPE-C-16P-QTWT]  116.34 5.58 0 top
USB2  TYPE-C 16P QTWT  [USB-TYPE-C-SMD_TYPE-C-16P-QTWT]  97.8 5.58 0 top

## Footprints (pads in the part's own frame, mm; a bottom-side part is the same pattern mirrored in y, then rotated)
1.3inch OLED module
  round 1.524 hole 0.914: 1(9.38,32.25) 2(11.92,32.25) 3(14.46,32.25) 4(17,32.25) 5(19.54,32.25) 6(22.08,32.25) 7(24.62,32.25)
2.8inch TFT LCD
  round 1.524 hole 0.914: 1(0,0) 2(-2.54,0) 3(-5.08,0) 4(-7.62,0) 5(-10.16,0) 6(-12.7,0) 7(-15.24,0) 8(-17.78,0) 9(-20.32,0) 10(-22.86,0) 11(-25.4,0) 12(-27.94,0) 13(-30.48,0) 14(-33.02,0) 15(-12.702,81) 16(-15.242,81) 17(-17.782,81) 18(-20.322,81)
2.54 - 4P
  round 1.524 hole 0.914: 1(0,0) 2(2.54,0) 3(5.08,0) 4(7.62,0)
a4988 module
  round 1.524 hole 0.914: 1(0,0) 2(0,-2.54) 3(0,-5.08) 4(0,-7.62) 5(0,-10.16) 6(0,-12.7) 7(0,-15.24) 8(0,-17.78) 9(12.7,0) 10(12.7,-2.54) 11(12.7,-5.08) 12(12.7,-7.62) 13(12.7,-10.16) 14(12.7,-12.7) 15(12.7,-15.24) 16(12.7,-17.78)
C1206_
  rect 1.485x1.728 smd: 1(-1.524,0) 2(1.661,0)
CAP-TH_BD6.3-P2.50-D1.0-FD
  round 1.6 hole 1: 1(-1.27,0) 2(1.27,0)
CASE-D_7343
  rect 2.799x3.01 smd: 1(3,0) 2(-3,0)
CONN-TH_2P-P5.00_L7.6-W10.0
  round 2 hole 1.3: 1(-2.5,0) 2(2.5,0)
esp32c3-mini
  custom 3.028x1.514 smd: 0(17.195,-19.532) 1(17.195,-16.992) 2(17.195,-14.453) 3(17.195,-11.912) 3V(17.195,-6.832) 4(17.195,-9.373) 5(0.815,-1.742) 5V(17.195,-1.752) 6(0.815,-4.282) 7(0.815,-6.822) 8(0.815,-9.362) 9(0.815,-11.902) 10(0.815,-14.442) G(17.195,-4.293) RXD(0.815,-16.982) TXD(0.815,-19.522)
LED1206-RD-R_RED
  rect 1.635x1.6 smd: 1(-1.518,0) 2(1.518,0)
R1206-1
  rect 1.1x2.5 smd: 1(-1.7,0) 2(1.7,0)
SOD-323_L1.6-W1.3-LS2.7-RD
  rect 0.9x0.7 smd: 1(-1.3,0) 2(1.3,0)
SOD-323_L1.8-W1.3-LS2.5-RD
  rect 1x0.75 smd: 1(-1.173,0) 2(1.173,0)
SOP-8_L4.9-W3.9-P1.27-LS6.0-BL
  oval 0.63x1.865 smd: 1(-1.905,-2.683) 2(-0.635,-2.683) 3(0.635,-2.683) 4(1.905,-2.683) 5(1.905,2.683) 6(0.635,2.683) 7(-0.635,2.683) 8(-1.905,2.683)
SOT-223-3_L6.4-W3.5-P2.30-LS7.0-BR
  rect 2.5x1.1 smd: 1(2.97,-2.3) 2(2.97,0) 3(2.97,2.3)
  rect 2.34x3.6 smd: 4(-2.97,0)
stm32f411ceu6
  round 1.524 hole 0.914: 1(34.038,-10.46) 2(34.038,-7.92) 3(34.038,-5.38) 4(34.038,-2.84) 5(34.038,-0.3) 6(34.038,2.24) 7(34.038,4.78) 8(34.038,7.32) 9(34.038,9.86) 10(34.038,12.4) 11(34.038,14.94) 12(34.038,17.48) 13(34.038,20.02) 14(34.038,22.56) 15(34.038,25.1) 16(34.038,27.64) 17(34.038,30.18) 18(34.038,32.72) 19(34.038,35.26) 20(34.038,37.8) 21(18.799,37.8) 22(18.799,35.26) 23(18.799,32.72) 24(18.799,30.18) 25(18.799,27.64) 26(18.799,25.1) 27(18.799,22.56) 28(18.799,20.02) 29(18.799,17.48) 30(18.799,14.94) 31(18.799,12.4) 32(18.799,9.86) 33(18.799,7.32) 34(18.799,4.78) 35(18.799,2.24) 36(18.799,-0.3) 37(18.799,-2.84) 38(18.799,-5.38) 39(18.799,-7.92) 40(18.799,-10.46)
SW-SMD_3P-L7.6-W6.0-P2.54-LS9.3-BL
  rect 1.2x2 smd: 1(-2.54,-4.45) 2(0,-4.45) 3(2.54,-4.45) 4(2.54,4.45) 5(0,4.45) 6(-2.54,4.45)
SW-SMD_4P-L6.0-W6.0-P4.50-LS9.0-2
  rect 2.3x1.5 smd: 1(-4.55,2.25) 2(4.55,2.25) 3(-4.55,-2.25) 4(4.55,-2.25)
TO-263-2_L10.2-W8.5-P2.54-LS15.2-TL
  rect 3.5x1.5 smd: 1(-5.652,2.54) 3(-5.652,-2.54)
  rect 8x11 smd: 2(5.652,0)
USB-TYPE-C-SMD_TYPE-C-16P-QTWT
  rect 1.7x1.2 smd: 0(-5.2,1.891) 0(5.2,1.891)
  rect 1.7x1.5 smd: 0(-5.2,-2.309) 0(5.2,-2.309)
  rect 0.5x1.14 smd: A1(-3.2,2.308) A4(-2.4,2.308) A9(2.4,2.308) A12(3.2,2.308)
  rect 0.3x1.14 smd: A5(-1.25,2.308) A6(-0.25,2.308) A7(0.25,2.308) A8(1.25,2.309) B5(1.75,2.308) B6(0.75,2.308) B7(-0.75,2.308) B8(-1.75,2.309)

## Nets
As in the schematic.

Pads without a net: U2 4; U3 4; U8 1 2 5 6 16 28 29; U9 1 2 3 4 5; U14 9; USB1 A5 A8 B5 B8; USB2 A5 A8 B5 B8

## Via types
v1: diameter 0.61, hole 0.305, Top Layer to Bottom Layer, 96 vias
v2: diameter 0.762, hole 0.381, Top Layer to Bottom Layer, 1 via

## Routing (per net, layer and track width the routed paths; a pad name or vN(x,y) marks a point on that pad's centre or on a via; arc(x,y) is an arc through that point)
+3.3V: length 455.2
  Top Layer w0.254: 133.96,50.59 C2.1
  Top Layer w0.305: 104.44,30.61 102.87,30.61 101.85,31.62 98.81,31.62 ; 104.44,30.61 106.01,30.61 108.08,28.53 U3.8 110.72,30.78 111.09,31.16 111.09,31.17 ; 104.44,30.61 R7.2 ; 98.81,31.62 97.74,32.69 C4.2 ; 98.81,31.62 97.62,30.44 95.88,30.44 ; 111.09,31.17 113.82,31.17 114.53,30.45 U3.5 115.32,28.53 115.82,29.04 115.82,29.84 117.35,31.37 120.14,31.37 122.17,29.34 122.17,27.31 122.62,26.86 R8.2 v1(124.97,26.86) 124.97,31.11 129.54,35.69 135.38,35.69 141.22,41.53 141.22,48.76 140.72,49.27 C8.2 139.12,50.46 138.95,50.62 C2.1 ; 111.09,31.17 C5.2 109.15,32.71 107.95,33.91 107.95,40.89 107.31,41.53 U4.2 U4.4 107.28,50.62 C7.1 97.7,50.62 96.52,51.81 96.52,55.24 ; 96.52,55.24 92.71,59.05 50.29,59.05 48.26,61.09 48.26,99.31 U9.14 ; 96.52,55.24 93.98,52.7 C3.2 ; U1.4 U1.2 ; U1.4 133.96,50.59 ; U1.4 126.37,53.34 125.73,53.97 125.73,60.79 124.12,62.4 118.78,62.4 117.04,64.13 117.04,73.86 119.03,75.85 SW3.3 SW3.4 ; v1(76.2,32.13) 73.15,32.13 69.34,35.94 v1(63.5,35.94) ; C18.2 142.63,79.76 145.52,76.88 SW3.4 ; SW2.4 145.52,93.39 142.63,96.27 C17.2 ; SW2.4 SW2.3 ; SW2.4 147.49,92.36 148.25,91.6 148.25,76.62 147.49,75.85 SW3.4 ; 95.88,30.44 95.16,31.16 92.44,31.16 92.07,30.78 ; 95.88,30.44 U2.5 ; 142.23,14.73 142.23,9.3 137.58,4.65 R14.2 R13.2 127.3,4.65 126.49,5.46 v1(126.49,15.37) ; v1(90.68,30.78) 92.07,30.78 ; 92.07,30.78 U2.8
  Bottom Layer w0.305: v1(63.5,35.94) 63.5,27.26 51.19,14.95 ; v1(90.68,30.78) 77.55,30.78 v1(76.2,32.13) ; v1(126.49,15.37) 126.49,25.34 v1(124.97,26.86)
+5V: length 623.7
  Top Layer w0.508: v1(113.94,10.58) 113.94,7.89 ; v1(30.23,40.26) 30.23,34.67 U27.2 ; v1(79.5,39.75) 80.45,40.7 U17.3 81.91,45.08 83.19,46.36 C14.2 87.63,51.43 91.44,55.24 88.39,58.29 73.31,58.29 ; 128.69,42.08 110.59,42.08 109.62,43.05 U4.3 v1(109.62,47.62) 111.28,49.29 C6.2 C1.2 ; 128.69,42.08 132.55,42.08 134.62,40 ; 128.69,42.08 128.66,42.1 128.66,44.65 ; U19.2 34.8,80.9 36.58,79.12 36.58,70.99 32.51,66.93 28.96,66.93 27.69,65.66 27.69,61.09 U24.2 ; 118.74,7.89 v1(118.74,10.58) 121.33,10.58 125.39,6.52 125.39,3.47 126.91,1.95 138.6,1.95 147.31,10.66 147.31,14.73 ; U13.2 30.48,106.04 12.19,106.04 U12.2 ; 73.31,58.29 71.12,56.1 71.12,54.1 ; 73.31,58.29 52.45,58.29 50.17,56.01 D3.2 ; R3.2 R2.2 R1.2 v1(74.68,14.77) ; U23.2 6.35,57.02 4.32,54.99 4.32,39.75 U26.2 ; v1(100.2,10.58) 100.2,7.89 ; D4.2 70.02,54 66.68,50.66 C10.2 62.2,46.36 60.96,45.13 U7.3 ; v1(39.12,33.12) v1(39.12,30.61) ; v1(95.4,10.58) 95.4,7.89
  Bottom Layer w0.254: v1(30.23,40.26) 30.23,55.5 U24.2
  Bottom Layer w0.508: U26.2 16,33.15 21.08,28.07 21.08,17.14 22.61,15.62 24.64,15.62 30.73,21.72 32.77,21.72 39.12,28.07 v1(39.12,30.61) ; v1(79.5,39.75) 74.68,34.92 v1(74.68,14.77) 86.7,14.77 90.89,10.58 v1(95.4,10.58) v1(100.2,10.58) v1(113.94,10.58) v1(118.74,10.58) ; U13.2 38.86,111.89 57.15,111.89 91.44,77.6 91.44,55.24 99.06,47.62 v1(109.62,47.62) ; U12.2 12.7,103 12.7,82.68 U18.2 12.7,79.12 12.7,58.8 U23.2 ; v1(39.12,33.12) 31.78,33.12 U27.2
GND: length 207.3
  Top Layer w0.254: USB1.0 v1(107.1,3.27) USB2.0 ; USB1.0 USB1.0 ; USB1.0 USB1.0 USB1.0 121.54,9.02 121.28,9.27 119.76,9.27 119.54,9.05 119.54,7.89 ; 137.16,40 135.64,41.53 134.62,41.53 133.99,42.16 C2.2 136.14,44.62 137.6,46.08 C8.1 ; 113.14,7.89 v1(113.14,9.41) ; v1(94.61,21.46) U2.3 94.61,24.57 93.59,25.59 91.95,25.59 88.9,28.64 88.9,31.18 90.41,32.69 C4.1 ; USB2.0 USB2.0 USB2.0 ; USB2.0 USB2.0 103,9.02 102.74,9.27 101.22,9.27 101,9.05 101,7.89 ; U28.2 21.55,4.44 27.27,4.44 U29.2 32.98,3.81 SW1.1 SW1.2 SW1.3 ; v1(127,35.75) 123.96,32.71 C5.1 ; 144.77,14.73 144.77,10.81 v1(144.78,10.79) ; U3.3 v1(113.26,21.48) ; v1(119.38,77.66) 120.9,77.66 121.92,78.68 R12.1 ; 94.6,7.89 v1(94.6,9.41) ; 121.92,96.09 v1(121.92,94.17)
  Top Layer w0.508: C9.1 v1(53.09,43.18) ; v1(103.12,49.47) 105.01,47.58 U4.1 104.99,44.62 C7.2 96.73,44.62 95.25,46.1 C3.1 93.98,44.39 92.77,43.18 C14.1 ; C13.1 C10.1 v1(63.5,43.18) ; v1(111.76,47.43) 111.76,46.61 112.27,46.1 C6.1 C1.1 120.65,44.89 120.89,44.65 U1.1
  Top Layer w0.762: U17.2 85.85,52.01 87.38,53.53 v1(87.38,55.05) ; v1(58.42,46.42) U7.2
VCC: length 298.6
  Top Layer w0.762: U7.1 55.88,45.13 54.64,46.36 C9.2 D3.1 ; U7.1 v1(58.42,40.7) ; U7.1 v1(53.34,40.7) ; D4.1 C13.2 75.43,46.36 76.84,44.96 U17.1 v1(63.5,40.7)
  Top Layer w1.016: 13.46,41.78 13.46,39.24 16,36.7 C21.1 13.46,17.91 U26.8 ; 13.46,41.78 C19.1 16,60.58 13.46,63.12 13.46,65.66 ; 13.46,41.78 U23.8 ; U19.8 34.29,65.66 ; 34.29,65.66 C16.1 38.1,69.47 38.1,79.38 35.05,82.42 v2(35.05,84.2) ; 34.29,65.66 34.29,63.12 36.83,60.58 C20.1 34.29,41.78 ; 34.29,41.78 U24.8 ; 34.29,41.78 34.29,39.24 36.83,36.7 C22.1 34.29,17.91 U27.8 ; U18.8 13.46,65.66 ; 13.46,65.66 C15.1 16,84.45 13.46,86.99 13.46,89.53 ; 13.46,89.53 C11.1 ; 13.46,89.53 U12.8 ; C12.1 34.29,89.53 U13.8
  Top Layer w1.27: U28.1 16.55,9.53 22.27,9.53 U29.1
  Bottom Layer w0.762: v1(63.5,40.7) v1(58.42,40.7) ; v1(53.34,40.7) 51.63,38.99 42.16,38.99 C20.1
  Bottom Layer w1.016: v2(35.05,84.2) 35.05,86.23 U13.8 ; U26.8 10.92,10.07 U28.1 ; U29.1 31.75,13.93 U27.8
BLK_C3: length 127.7
  Top Layer w0.254: v1(139.7,28.07) 139.7,31.11 ; v1(65.02,80.14) 54.06,80.14 U9.7
  Bottom Layer w0.254: v1(139.7,28.07) 137.41,25.78 135.89,25.78 134.37,27.31 130.81,27.31 121.67,36.45 90.93,36.45 65.02,62.36 v1(65.02,80.14)
BTN1: length 19
  Top Layer w0.254: v1(105.41,71.63) R15.1
  Bottom Layer w0.254: v1(105.41,71.63) 104.14,70.36 104.14,55.24
BTN2: length 11.9
  Top Layer w0.254: R16.1 v1(107.52,64.39)
  Bottom Layer w0.254: 106.68,55.24 106.68,63.55 v1(107.52,64.39)
CS_C3: length 131.7
  Top Layer w0.254: U9.12 56.6,90.3 v1(66.04,90.3) ; v1(134.62,28.07) 134.62,31.11
  Bottom Layer w0.254: v1(134.62,28.07) 131.06,28.07 121.92,37.21 91.44,37.21 66.04,62.61 v1(66.04,90.3)
CS_STM: length 50.1
  Top Layer w0.254: U25.7 52.07,28.53 52.07,30.1 56.64,34.67 67.56,34.67 71.12,31.11 83.57,31.11 83.82,31.37 83.82,32.89 89.15,38.23 89.66,38.23 91.44,40
DC_C3: length 133.1
  Top Layer w0.254: v1(60.96,86.23) 55.63,86.23 50.5,91.35 U9.10 ; v1(132.07,23.5) 132.07,14.73
  Bottom Layer w0.254: v1(132.07,23.5) 131.31,24.26 129.79,24.26 120.65,33.4 88.9,33.4 60.96,61.34 v1(60.96,86.23)
DC_STM: length 58.2
  Top Layer w0.254: 96.52,40 93.98,37.46 92.71,37.46 91.95,36.7 90.17,36.7 85.6,32.13 85.6,30.35 84.33,29.08 70.1,29.08 65.28,33.91 57.15,33.91 53.09,29.84 53.09,27 U25.6
DIR: length 274.1
  Top Layer w0.254: v1(50.46,61.13) 51.73,62.4 51.73,64.18 54.23,66.67 v1(71.37,66.67) ; U27.9 47.24,38.48 v1(47.24,59.56) v1(47.24,86.23) 47.24,97.16 45.97,98.42 42.93,98.42 41.91,99.44 41.91,104.77 U13.9 43.18,108.58 24.89,108.58 U12.9 ; v1(44.45,63.12) U24.9 ; U19.9 v1(44.45,86.23) ; v1(41.4,86.23) v1(28.7,86.23)
  Bottom Layer w0.254: v1(41.4,86.23) v1(44.45,86.23) v1(47.24,86.23) ; U24.9 v1(47.24,59.56) 48.89,59.56 v1(50.46,61.13) ; U23.9 27.18,63.12 v1(44.45,63.12) ; v1(71.37,66.67) 71.37,64.13 90.93,44.58 103.63,44.58 104.39,43.81 115.82,43.81 116.59,43.05 119.89,43.05 120.65,42.29 123.95,42.29 124.71,41.53 125.48,41.53 127,40 ; U27.9 43.18,36.96 24.89,36.96 U26.9 ; v1(28.7,86.23) 26.42,86.23 U18.9
LED1: length 8.9
  Top Layer w0.254: LED5.1 140.17,59.1 139.16,58.08 137.46,58.08 134.62,55.24
LED2: length 8.1
  Top Layer w0.254: LED6.1 136.75,59.1 135.73,58.08 134.79,58.08 132.08,55.37 132.08,55.24
M0_A+: length 14.5
  Top Layer w0.508: U5.4 8.13,103.5 13.46,103.5 14.73,102.23 14.73,100.97 13.46,99.69 U12.4
M0_A-: length 5.1
  Top Layer w0.508: U12.3 8.38,99.69 U5.3
M0_B+: length 5.1
  Top Layer w0.508: U5.1 8.38,94.61 U12.5
M0_B-: length 14.5
  Top Layer w0.508: U12.6 13.46,94.61 14.73,95.88 14.73,97.16 13.46,98.42 8.13,98.42 U5.2
M1_A+: length 14.5
  Top Layer w0.508: U18.4 13.46,75.82 14.73,77.09 14.73,78.36 13.46,79.63 8.13,79.63 U10.4
M1_A-: length 5.1
  Top Layer w0.508: U18.3 8.38,75.82 U10.3
M1_B+: length 5.1
  Top Layer w0.508: U10.1 8.38,70.74 U18.5
M1_B-: length 14.5
  Top Layer w0.508: U10.2 8.13,74.55 13.46,74.55 14.73,73.28 14.73,72.01 13.46,70.74 U18.6
M2_A+: length 14.5
  Top Layer w0.508: U23.4 13.46,51.94 14.73,53.21 14.73,54.48 13.46,55.75 8.13,55.75 U15.4
M2_A-: length 5.1
  Top Layer w0.508: U15.3 8.38,51.94 U23.3
M2_B+: length 5.1
  Top Layer w0.508: U23.5 8.38,46.86 U15.1
M2_B-: length 14.5
  Top Layer w0.508: U23.6 13.46,46.86 14.73,48.13 14.73,49.4 13.46,50.67 8.13,50.67 U15.2
M3_A+: length 14.5
  Top Layer w0.508: U26.4 13.46,28.07 14.73,29.34 14.73,30.61 13.46,31.88 8.13,31.88 U20.4
M3_A-: length 5.1
  Top Layer w0.508: U20.3 8.38,28.07 U26.3
M3_B+: length 5.1
  Top Layer w0.508: U26.5 8.38,22.99 U20.1
M3_B-: length 14.5
  Top Layer w0.508: U20.2 8.13,26.8 13.46,26.8 14.73,25.53 14.73,24.26 13.46,22.99 U26.6
M4_A+: length 14.5
  Top Layer w0.508: U6.4 28.96,103.5 34.29,103.5 35.56,102.23 35.56,100.97 34.29,99.69 U13.4
M4_A-: length 5.1
  Top Layer w0.508: U6.3 29.21,99.69 U13.3
M4_B+: length 5.1
  Top Layer w0.508: U13.5 29.21,94.61 U6.1
M4_B-: length 14.5
  Top Layer w0.508: U6.2 28.96,98.42 34.29,98.42 35.56,97.16 35.56,95.88 34.29,94.61 U13.6
M5_A+: length 14.5
  Top Layer w0.508: U11.4 28.96,79.63 34.29,79.63 35.56,78.36 35.56,77.09 34.29,75.82 U19.4
M5_A-: length 5.1
  Top Layer w0.508: U19.3 29.21,75.82 U11.3
M5_B+: length 5.1
  Top Layer w0.508: U19.5 29.21,70.74 U11.1
M5_B-: length 14.5
  Top Layer w0.508: U19.6 34.29,70.74 35.56,72.01 35.56,73.28 34.29,74.55 28.96,74.55 U11.2
M6_A+: length 14.5
  Top Layer w0.508: U16.4 28.96,55.75 34.29,55.75 35.56,54.48 35.56,53.21 34.29,51.94 U24.4
M6_A-: length 5.1
  Top Layer w0.508: U16.3 29.21,51.94 U24.3
M6_B+: length 5.1
  Top Layer w0.508: U16.1 29.21,46.86 U24.5
M6_B-: length 14.5
  Top Layer w0.508: U24.6 34.29,46.86 35.56,48.13 35.56,49.4 34.29,50.67 28.96,50.67 U16.2
M7_A+: length 14.5
  Top Layer w0.508: U27.4 34.29,28.07 35.56,29.34 35.56,30.61 34.29,31.88 28.96,31.88 U21.4
M7_A-: length 5.1
  Top Layer w0.508: U27.3 29.21,28.07 U21.3
M7_B+: length 5.1
  Top Layer w0.508: U27.5 29.21,22.99 U21.1
M7_B-: length 14.5
  Top Layer w0.508: U21.2 28.96,26.8 34.29,26.8 35.56,25.53 35.56,24.26 34.29,22.99 U27.6
MIDI_RX: length 46.4
  Top Layer w0.254: 147.32,31.11 147.32,33.86 142.75,38.44 142.75,50.16 139.27,53.64 v1(130.83,53.64)
  Bottom Layer w0.254: 119.38,55.24 120.98,53.64 v1(130.83,53.64)
MISO_C3: length 126.5
  Top Layer w0.254: U9.6 53.55,78.1 v1(61.98,78.1) ; v1(134.61,23.5) 134.61,14.73
  Bottom Layer w0.254: v1(61.98,78.1) 61.98,61.59 89.41,34.16 120.9,34.16 130.05,25.02 133.1,25.02 133.1,25.01 v1(134.61,23.5)
MOSI_C3: length 135.5
  Top Layer w0.254: U9.9 55.07,84.2 v1(64.01,84.2) ; v1(142.24,28.07) 142.24,31.11
  Bottom Layer w0.254: v1(142.24,28.07) 139.19,25.02 135.64,25.02 134.11,26.54 130.56,26.54 121.41,35.69 90.42,35.69 64.01,62.1 v1(64.01,84.2)
MOSI_STM: length 64.1
  Top Layer w0.254: U25.4 55.12,23.95 55.12,29.34 58.17,32.38 65.53,32.38 69.85,28.07 84.84,28.07 86.61,29.84 86.61,31.88 90.68,35.94 93.73,35.94 95.25,37.46 96.52,37.46 99.06,40
MS1: length 219.2
  Top Layer w0.254: U13.15 42.93,90.55 42.93,69.72 U19.15 42.93,66.67 42.93,45.85 U24.15 42.93,42.8 42.93,21.97 U27.15 ; U12.15 22.1,90.55 22.1,69.72 U18.15 22.1,66.67 22.1,45.85 U23.15 22.1,42.8 22.1,21.97 U26.15 29.46,14.6 44.45,14.6 45.47,13.59 45.47,11.05 48.01,8.51 53.43,8.51 59.69,14.77 R4.1
  Bottom Layer w0.254: U12.15 24.89,90.8 43.18,90.8 U13.15
MS2: length 216
  Top Layer w0.254: U26.14 30.48,16.13 43.94,16.13 v1(46.48,13.59) 46.48,11.81 48.77,9.53 52.83,9.53 58.17,14.86 58.17,18.33 59.69,19.85 R5.1 ; U12.14 24.89,94.61 27.69,91.82 27.69,89.53 29.97,87.25 39.37,87.25 41.91,89.79 41.91,92.07 U13.14 45.97,93.09 45.97,72.26 U19.14 45.97,69.21 45.97,48.39 U24.14
  Bottom Layer w0.254: U27.14 46.48,20.95 v1(46.48,13.59) ; U26.14 22.1,24.51 22.1,45.34 U23.14 22.1,48.39 22.1,69.21 U18.14 22.1,72.26 22.1,93.09 U12.14
MS3: length 232.2
  Top Layer w0.254: U13.13 40.89,93.6 40.89,90.55 v1(39.88,89.53) ; U27.13 47.5,22.48 47.5,12.57 49.53,10.54 52.07,10.54 57.15,15.62 57.15,22.39 59.69,24.93 R6.1 ; U12.13 23.37,97.16 22.1,95.88 22.1,93.85 22.61,93.34 24.64,93.34 25.15,92.84 25.15,74.8 U18.13 25.15,71.75 25.15,50.93 U23.13 25.15,47.88 25.15,27.05 U26.13 ; v1(39.88,78.36) v1(39.88,75.82) 41.91,73.79 v1(41.91,59.56) v1(41.91,25.53)
  Bottom Layer w0.254: v1(41.91,59.56) 42.93,58.55 42.93,50.93 U24.13 ; U19.13 42.42,73.28 v1(39.88,75.82) ; U13.13 43.18,98.42 24.89,98.42 U12.13 ; v1(39.88,89.53) v1(39.88,78.36) ; U27.13 v1(41.91,25.53)
PA4: length 70.5
  Bottom Layer w0.254: U9.18 133.1,87.18 133.1,80.14 116.84,63.88 116.84,55.24 120.65,51.43 U22.4
PA5: length 66.2
  Bottom Layer w0.254: U22.3 120.65,48.89 114.3,55.24 114.3,64.04 U9.15
PA6: length 73.4
  Bottom Layer w0.254: U9.16 111.76,64.04 111.76,55.24 119.38,47.62 129.79,47.62 131.06,46.35 U22.2
PA7: length 80.5
  Bottom Layer w0.254: U22.1 132.33,43.81 129.29,46.86 117.6,46.86 109.22,55.24 109.22,64.04 U9.17
RESET_C3: length 132.9
  Top Layer w0.254: U9.11 56.09,88.26 v1(59.94,88.26) ; v1(129.53,23.5) 129.53,14.73
  Bottom Layer w0.254: v1(129.53,23.5) 120.39,32.64 88.39,32.64 59.94,61.09 v1(59.94,88.26)
RESET_STM: length 89.1
  Top Layer w0.254: v1(61.21,29.59) 63.75,27.05 85.34,27.05 87.63,29.34 87.63,31.37 91.44,35.18 95.5,35.18 97.79,37.46 99.31,37.46 v1(100.33,38.48) ; v1(61.21,33.15) 57.66,33.15 54.1,29.59 54.1,25.48 51.19,22.57
  Bottom Layer w0.254: v1(100.33,38.48) 100.84,37.97 119.89,37.97 121.92,40 ; v1(61.21,33.15) v1(61.21,29.59)
RXD340ESP: length 48.9
  Top Layer w0.254: D2.1 121.94,13.33 121.44,12.83 113.66,12.83 112.65,13.84 112.65,14.78 111.63,15.8 110.32,15.8 110.32,16.98 110.84,17.5 116.17,17.5 117.19,18.51 117.19,21.68 118.02,22.52 119.04,22.52 121.44,24.92 121.44,28.88 119.91,30.41 118.14,30.41 116.87,29.14 116.87,27.61 115.85,26.6 113.77,26.6 113.26,27.11 U3.6
RXD340STM: length 49.1
  Top Layer w0.254: D1.1 102.9,13.33 102.39,12.83 94.87,12.83 93.85,13.84 93.85,14.72 92.84,15.74 LED1.1 91.35,16.92 91.86,17.44 97.2,17.44 98.21,18.46 98.21,21.76 98.97,22.52 100.24,22.52 102.78,25.06 102.78,28.87 101.26,30.39 99.48,30.39 98.21,29.12 98.21,27.6 97.2,26.58 95.12,26.58 94.61,27.09 U2.6
RXDESP: length 20.4
  Top Layer w0.254: D2.2 123.87,16.68 125.39,18.2 125.39,23.28 130.22,28.11 131.23,28.11 132.08,28.96 132.08,31.11
RXDSTM: length 27.4
  Top Layer w0.254: 106.68,40 v1(106.68,31.62) ; v1(107.95,21.97) 107.95,21.21 107.19,20.45 107.19,18.41 105.45,16.68 D1.2
  Bottom Layer w0.254: v1(107.95,21.97) 107.95,30.35 v1(106.68,31.62)
SCL2: length 92.9
  Top Layer w0.254: R13.1 130.18,9.27 130.98,10.07 135.55,10.07 137.15,11.67 137.15,14.73 137.16,14.75 137.16,17.91 143.51,24.26 v1(146.05,24.26)
  Bottom Layer w0.254: v1(146.05,24.26) 146.05,30.35 139.7,36.7 133.86,36.7 133.35,37.21 133.35,41.53 128.78,46.1 115.82,46.1 108.2,53.72 100.58,53.72 99.06,55.24
SCLK_C3: length 136.5
  Top Layer w0.254: v1(62.99,82.17) 54.56,82.17 U9.8 ; v1(144.78,28.07) 144.78,31.11
  Bottom Layer w0.254: v1(62.99,82.17) 62.99,61.85 89.92,34.92 121.16,34.92 130.3,25.78 133.6,25.78 135.13,24.26 140.97,24.26 v1(144.78,28.07)
SCLK_STM: length 58.8
  Top Layer w0.254: U25.3 56.13,22.43 56.13,29.08 58.67,31.62 64.52,31.62 v1(65.28,30.86) ; v1(69.09,31.62) 70.61,30.1 83.82,30.1 84.58,30.86 84.58,32.38 89.66,37.46 91.44,37.46 93.98,40
  Bottom Layer w0.254: v1(69.09,31.62) 68.33,30.86 v1(65.28,30.86)
SDA2: length 92.9
  Top Layer w0.254: 116.84,40 116.84,38.73 117.35,38.23 v1(135.89,38.23) ; R14.1 137.59,8.05 139.69,10.15 139.69,18.15 141.48,19.94 143,19.94 143.51,19.43 143.51,18.16 143.76,17.91 144.02,17.91 144.27,18.16 144.27,23.24 144.53,23.5 144.78,23.5 145.03,23.24 145.03,18.16 145.29,17.91 145.54,17.91 145.8,18.16 145.8,23.24 146.05,23.5 146.3,23.5 146.56,23.24 146.56,18.16 146.81,17.91 147.07,17.91 147.32,18.16 v1(147.32,24.26)
  Bottom Layer w0.254: v1(135.89,38.23) 139.95,38.23 147.32,30.86 v1(147.32,24.26)
STEP_0: length 126.8
  Bottom Layer w0.254: U12.10 25.91,102.49 25.91,101.47 26.42,100.97 45.21,100.97 45.97,100.2 66.8,100.2 68.07,98.93 68.07,62.36 88.9,41.53 100.08,41.53 101.6,40
STEP_1: length 113
  Top Layer w0.254: v1(68.83,70.99) 64.98,74.84 v1(56.56,74.84)
  Bottom Layer w0.254: v1(68.83,70.99) 68.83,62.86 89.41,42.29 101.09,42.29 101.85,41.53 112.78,41.53 114.3,40 ; v1(56.56,74.84) 47.46,74.84 45.21,77.09 26.42,77.09 25.91,77.6 25.91,78.61 U18.10
STEP_2: length 115.5
  Top Layer w0.254: v1(54.27,67.99) v1(69.6,67.99)
  Bottom Layer w0.254: 119.38,40 117.86,41.53 114.55,41.53 113.79,42.29 102.87,42.29 102.11,43.05 89.92,43.05 69.6,63.37 v1(69.6,67.99) ; v1(54.27,67.99) 53.51,67.99 50.46,64.94 50.46,63.41 48.94,61.89 30.69,61.89 25.82,57.02 U23.10
STEP_3: length 111.9
  Top Layer w0.254: v1(89.92,44.32) 86.36,44.32 85.85,43.81 85.85,38.99 84.33,37.46 v1(50.04,37.46)
  Bottom Layer w0.254: v1(89.92,44.32) 90.42,43.81 102.87,43.81 103.63,43.05 114.81,43.05 115.57,42.29 118.87,42.29 119.63,41.53 122.94,41.53 124.46,40 ; U26.10 24.89,31.88 45.72,31.88 46.99,33.15 46.99,34.42 v1(50.04,37.46)
STEP_4: length 100.5
  Top Layer w0.254: 124.46,55.24 118.11,61.59 102.87,61.59 61.72,102.74 46.48,102.74 U13.10
STEP_5: length 88.1
  Top Layer w0.254: v1(56.56,76.11) 85.81,76.11 101.6,60.32 116.84,60.32 121.92,55.24
  Bottom Layer w0.254: v1(56.56,76.11) 53,76.11 51.73,77.38 47.97,77.38 U19.10
STEP_6: length 95.3
  Top Layer w0.254: v1(75.95,60.83) v1(58.17,60.83)
  Bottom Layer w0.254: U24.10 54.36,57.02 v1(58.17,60.83) ; 129.54,40 128.02,41.53 127.25,41.53 126.49,42.29 125.73,42.29 124.97,43.05 121.67,43.05 120.9,43.81 117.6,43.81 116.84,44.58 104.9,44.58 104.14,45.34 91.44,45.34 v1(75.95,60.83)
STEP_7: length 100.2
  Top Layer w0.254: U27.10 49.53,38.23 84.07,38.23 85.09,39.24 85.09,44.07 85.85,44.83 88.65,44.83 91.19,47.37 v1(91.19,47.62)
  Bottom Layer w0.254: v1(91.19,47.62) 91.19,46.86 91.95,46.1 105.16,46.1 105.92,45.34 117.86,45.34 118.62,44.58 121.92,44.58 122.68,43.81 125.98,43.81 126.75,43.05 127.51,43.05 128.27,42.29 129.03,42.29 129.79,41.53 130.56,41.53 132.08,40
TXD340ESP: length 17.7
  Top Layer w0.254: R10.1 v1(123.47,23.55) ; U3.7 v1(111.99,26.6)
  Bottom Layer w0.254: v1(123.47,23.55) 115.04,23.55 v1(111.99,26.6)
TXD340STM: length 17.3
  Top Layer w0.254: R9.2 v1(104.44,23.54) ; U2.7 v1(93.34,26.58)
  Bottom Layer w0.254: v1(104.44,23.54) 96.39,23.54 v1(93.34,26.58)
TXDESP: length 25.7
  Top Layer w0.254: LED4.1 117.79,15.8 120.07,18.07 R10.2 121.07,20.51 121.83,21.28 121.83,23.28 123.1,24.55 125.48,24.55 129.54,28.62 129.54,31.11
TXDSTM: length 36.9
  Top Layer w0.254: 101.04,18.07 104.9,18.07 106.17,19.34 106.17,20.7 106.68,21.21 v1(106.68,21.97) ; 101.04,18.07 R9.1 ; 101.04,18.07 98.7,15.74 LED2.1 ; 104.14,40 v1(104.14,31.62)
  Bottom Layer w0.254: v1(106.68,21.97) 106.68,29.08 v1(104.14,31.62)
USB_D+ESP: length 30.1
  Top Layer w0.254: 116.09,7.89 116.09,6.26 115.34,5.52 ; 115.34,5.52 113.31,5.52 112.55,6.28 112.55,8.82 107.95,13.42 107.95,19.94 109.28,21.26 110.47,21.26 110.72,21.52 U3.1 ; 115.34,5.52 116.34,5.52 117.09,6.26 117.09,7.89
USB_D+STM: length 31.7
  Top Layer w0.254: 96.96,5.5 94.66,5.5 93.89,6.26 93.89,8.8 88.31,14.39 88.31,19.98 89.58,21.25 91.82,21.25 92.07,21.5 U2.1 ; 96.96,5.5 97.55,6.09 97.55,7.89 ; 96.96,5.5 97.96,5.5 98.55,6.09 98.55,7.89
USB_D-ESP: length 27.7
  Top Layer w0.254: 114.94,11.81 115.59,11.16 115.59,7.89 ; 114.94,11.81 115.95,11.81 116.59,11.17 116.59,7.89 ; 114.94,11.81 111.56,11.81 108.71,14.66 108.71,19.74 109.47,20.5 111.23,20.5 111.99,21.26 U3.2
USB_D-STM: length 29.8
  Top Layer w0.254: 96.39,11.81 91.9,11.81 89.07,14.65 89.07,19.73 89.83,20.49 92.58,20.49 93.34,21.25 U2.2 ; 96.39,11.81 97.41,11.81 98.05,11.17 98.05,7.89 ; 96.39,11.81 97.05,11.16 97.05,7.89
$1N1936: length 15.2
  Top Layer w0.254: 114.19,18.83 114.19,19.99 117.49,23.3 118.8,23.3 120.07,24.57 R8.1 ; 114.19,18.83 114.19,18.79 ; 114.19,18.83 LED3.2 ; 114.19,18.83 114.21,18.83 LED4.2
$1N2808: length 15.1
  Top Layer w0.254: R7.1 101.04,24.55 99.77,23.28 98.46,23.28 95.16,19.98 LED2.2 LED1.2
$1N4483: length 2.5
  Top Layer w0.254: U26.12 U26.11
$1N4488: length 2.5
  Top Layer w0.254: U27.12 U27.11
$1N4493: length 2.5
  Top Layer w0.254: U23.11 U23.12
$1N4498: length 2.5
  Top Layer w0.254: U24.12 U24.11
$1N4503: length 2.5
  Top Layer w0.254: U19.12 U19.11
$1N4508: length 2.5
  Top Layer w0.254: U13.12 U13.11
$1N4513: length 2.5
  Top Layer w0.254: U12.12 U12.11
$1N4518: length 2.5
  Top Layer w0.254: U18.11 U18.12
$1N11425: length 24.6
  Top Layer w0.254: LED5.2 140.17,66.72 135.26,71.63 R17.1
$1N11428: length 18.5
  Top Layer w0.254: LED6.2 136.75,65.52 135.46,66.8 R18.1
$1N16587: length 71.2
  Top Layer w0.254: R15.2 111.93,71.63 113.96,73.66 113.96,97.2 116.25,99.49 R11.2 135.29,99.49 136.42,98.36 SW2.1 139.03,96.86 139.45,97.28 C17.1 139.45,101.26 140.46,102.28 144.44,102.28 145.52,101.2 SW2.2
$1N16647: length 59.6
  Top Layer w0.254: R16.2 112.18,66.8 114.98,69.59 114.98,80.94 117.02,82.98 R12.2 121.92,81.96 122.68,81.19 128.44,81.19 129.96,79.67 133.01,79.67 133.69,80.35 SW3.1 139.03,80.35 139.45,80.77 C18.1 139.45,84.75 140.46,85.77 144.44,85.77 145.52,84.69 SW3.2
$1N18562: length 39.5
  Top Layer w0.254: v1(42.55,10.79) SW1.4 ; v1(62.48,22.22) 64,22.22 64.51,22.73 R6.2 R3.1
  Bottom Layer w0.254: v1(42.55,10.79) 43.05,10.29 58.17,10.29 58.93,11.05 58.93,18.67 v1(62.48,22.22)
$1N18573: length 38.3
  Top Layer w0.254: R2.1 R5.2 64.51,17.65 64,17.14 v1(62.48,17.14) ; v1(40,10.79) SW1.5
  Bottom Layer w0.254: v1(62.48,17.14) 59.69,14.35 59.69,10.54 58.67,9.53 41.28,9.53 v1(40,10.79)
$1N18582: length 37.2
  Top Layer w0.254: v1(37.47,10.79) SW1.6 ; R1.1 R4.2 64.51,12.57 64,12.06 v1(62.48,12.06)
  Bottom Layer w0.254: v1(62.48,12.06) 59.18,8.76 39.5,8.76 v1(37.47,10.79)

## Copper pours and planes (outline as drawn; the poured copper is in the pictures)
GND on Bottom Layer: -0.64,114.94 151.76,114.94 151.76,-1.91 -0.64,-1.91

Small or netless copper shapes (teardrops, artwork), in the pictures only: 499 on Top Layer, 137 on Bottom Layer
